# Altium project Node_STM32.PrjPcb
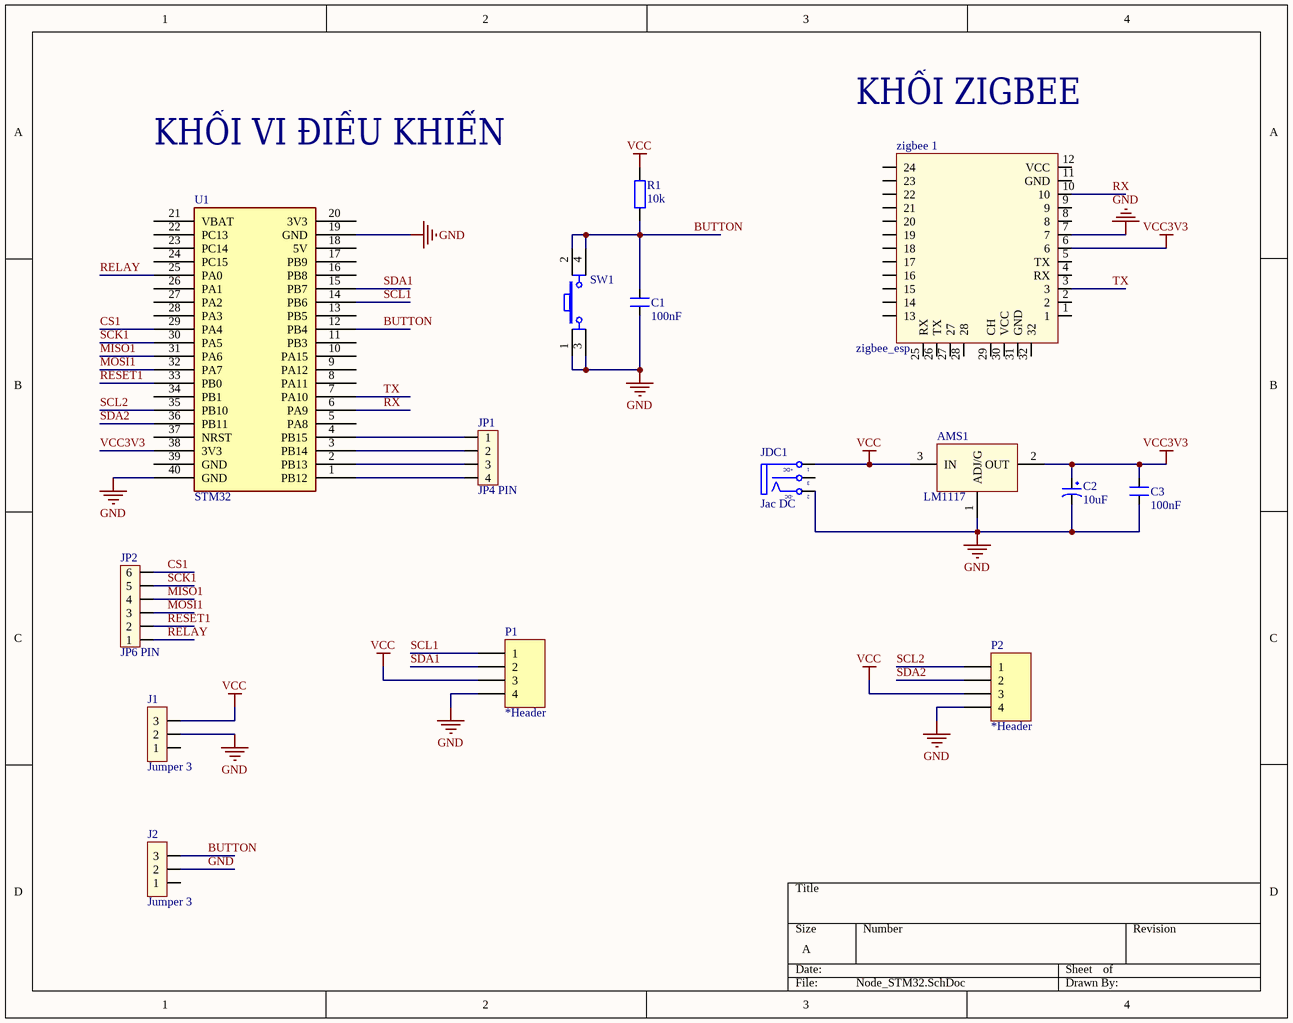
[diagram p0: Node_STM32.SchDoc]
1 sheet, 15 parts. Net scope: global (net labels, ports and power ports of the same name join across sheets).
Board file: Node_STM32.PcbDoc

## Sheet Node_STM32.SchDoc
size A; SheetNumber: 1; SheetTotal: 1

### Parts
AMS1  LM1117  [SOT223-4N]
C1  100nF  [CN1]
C2  10uF  [CP1/2]
C3  100nF  [CN1]
J1  Jumper 3  [JP3]
J2  Jumper 3  [JP3]
JDC1  Jac DC  [DC-IN]
JP1  JP4 PIN  [JP4]
JP2  JP6 PIN  [JP6]
P1  *Header  [HDR1X4]
P2  *Header  [HDR1X4]
R1  10k  [R1/4W]
SW1  SW  [SW4]  (value not drawn)
U1  STM32  [STM32]
zigbee_1  zigbee_esp  [zigbee]

### Nets
GND: AMS1.1(ADJ/G) C1.1 C2.2 C3.1 J1.2 J2.2 JDC1.2(TN) P1.4 P2.4 SW1.1 SW1.3 U1.19(GND) U1.40(GND) zigbee_1.7
VCC: AMS1.3(IN) J1.3 JDC1.1(T) P1.3 P2.3 R1.2
VCC3V3: AMS1.2(OUT) C2.1 C3.2 U1.38(3V3) zigbee_1.6
BUTTON: C1.2 J2.3 R1.1 SW1.2 SW1.4 U1.12(PB4)
CS1: JP2.6 U1.29(PA4)
MISO1: JP2.4 U1.31(PA6)
MOSI1: JP2.3 U1.32(PA7)
RELAY: JP2.1 U1.25(PA0)
RESET1: JP2.2 U1.33(PB0)
RX: U1.6(PA9) zigbee_1.10
SCK1: JP2.5 U1.30(PA5)
SCL1: P1.1 U1.14(PB6)
SCL2: P2.1 U1.35(PB10)
SDA1: P1.2 U1.15(PB7)
SDA2: P2.2 U1.36(PB11)
TX: U1.7(PA10) zigbee_1.3
NetJP1_1: JP1.1 U1.4(PB15)
NetJP1_2: JP1.2 U1.3(PB14)
NetJP1_3: JP1.3 U1.2(PB13)
NetJP1_4: JP1.4 U1.1(PB12)

Not connected (* = marked no-connect by the designer): J1 1; J2 1; JDC1 3(S); U1 5(PA8) 8(PA11) 9(PA12) 10(PA15) 11(PB3) 13(PB5) 16(PB8) 17(PB9) 18(5V) 20(3V3) 21(VBAT) 22(PC13) 23(PC14) 24(PC15) 26(PA1) 27(PA2) 28(PA3) 34(PB1) 37(NRST) 39(GND); zigbee_1 1 2 4(RX) 5(TX) 8 9 11(GND) 12(VCC) 13 14 15 16 17 18 19 20 21 22 23 24 25(RX) 26(TX) 27 28 29(CH) 30(VCC) 31(GND) 32

### Notes on the sheet
- KHỐI VI ĐIỀU KHIỂN
- KHỐI ZIGBEE
- (in symbol DCIN) +DC; -DC

### Library data of the parts
AMS1 = LM1117: Available in 1.8V, 2.5V, 2.85V, 3.3V, 5V, and  Adjustable Versions; Value: LM317
C1 C3 = CN0: Cremic For Xtal 1pF => 100pF; Value: 33pF
C2 = CP1: Cap P  0,1uF < 22uF , 16 - 50V; Value: 10uF/50V; Description 1: 10 => 220uF/6,3V/10V - 10uF => 100uF/16V; Description 2: 0,1uF => 33uF/50V - 10uF => 22uF/63V; Description 3: 0,47uF => 10uF/100V
J1 J2 = JP3: Value: J3
JDC1 = DCIN: Jac DC input; Value: Jac DC
JP1 = JP4: Value: JP4
JP2 = JP6: Value: JP7
P1 P2 = Header 4: Header, 4-Pin, Right Angle; LatestRevisionDate: 17-Jul-2002; LatestRevisionNote: Re-released for DXP Platform.; Publisher: Altium Limited
R1 = R1/4W: Resistor 1/4W; Value: R1/4W - 1K
SW1 = SW4: Switch button 4 pin; Value: Button chip 4 pin